# EAGLE schematic board (EAGLE 6.4)
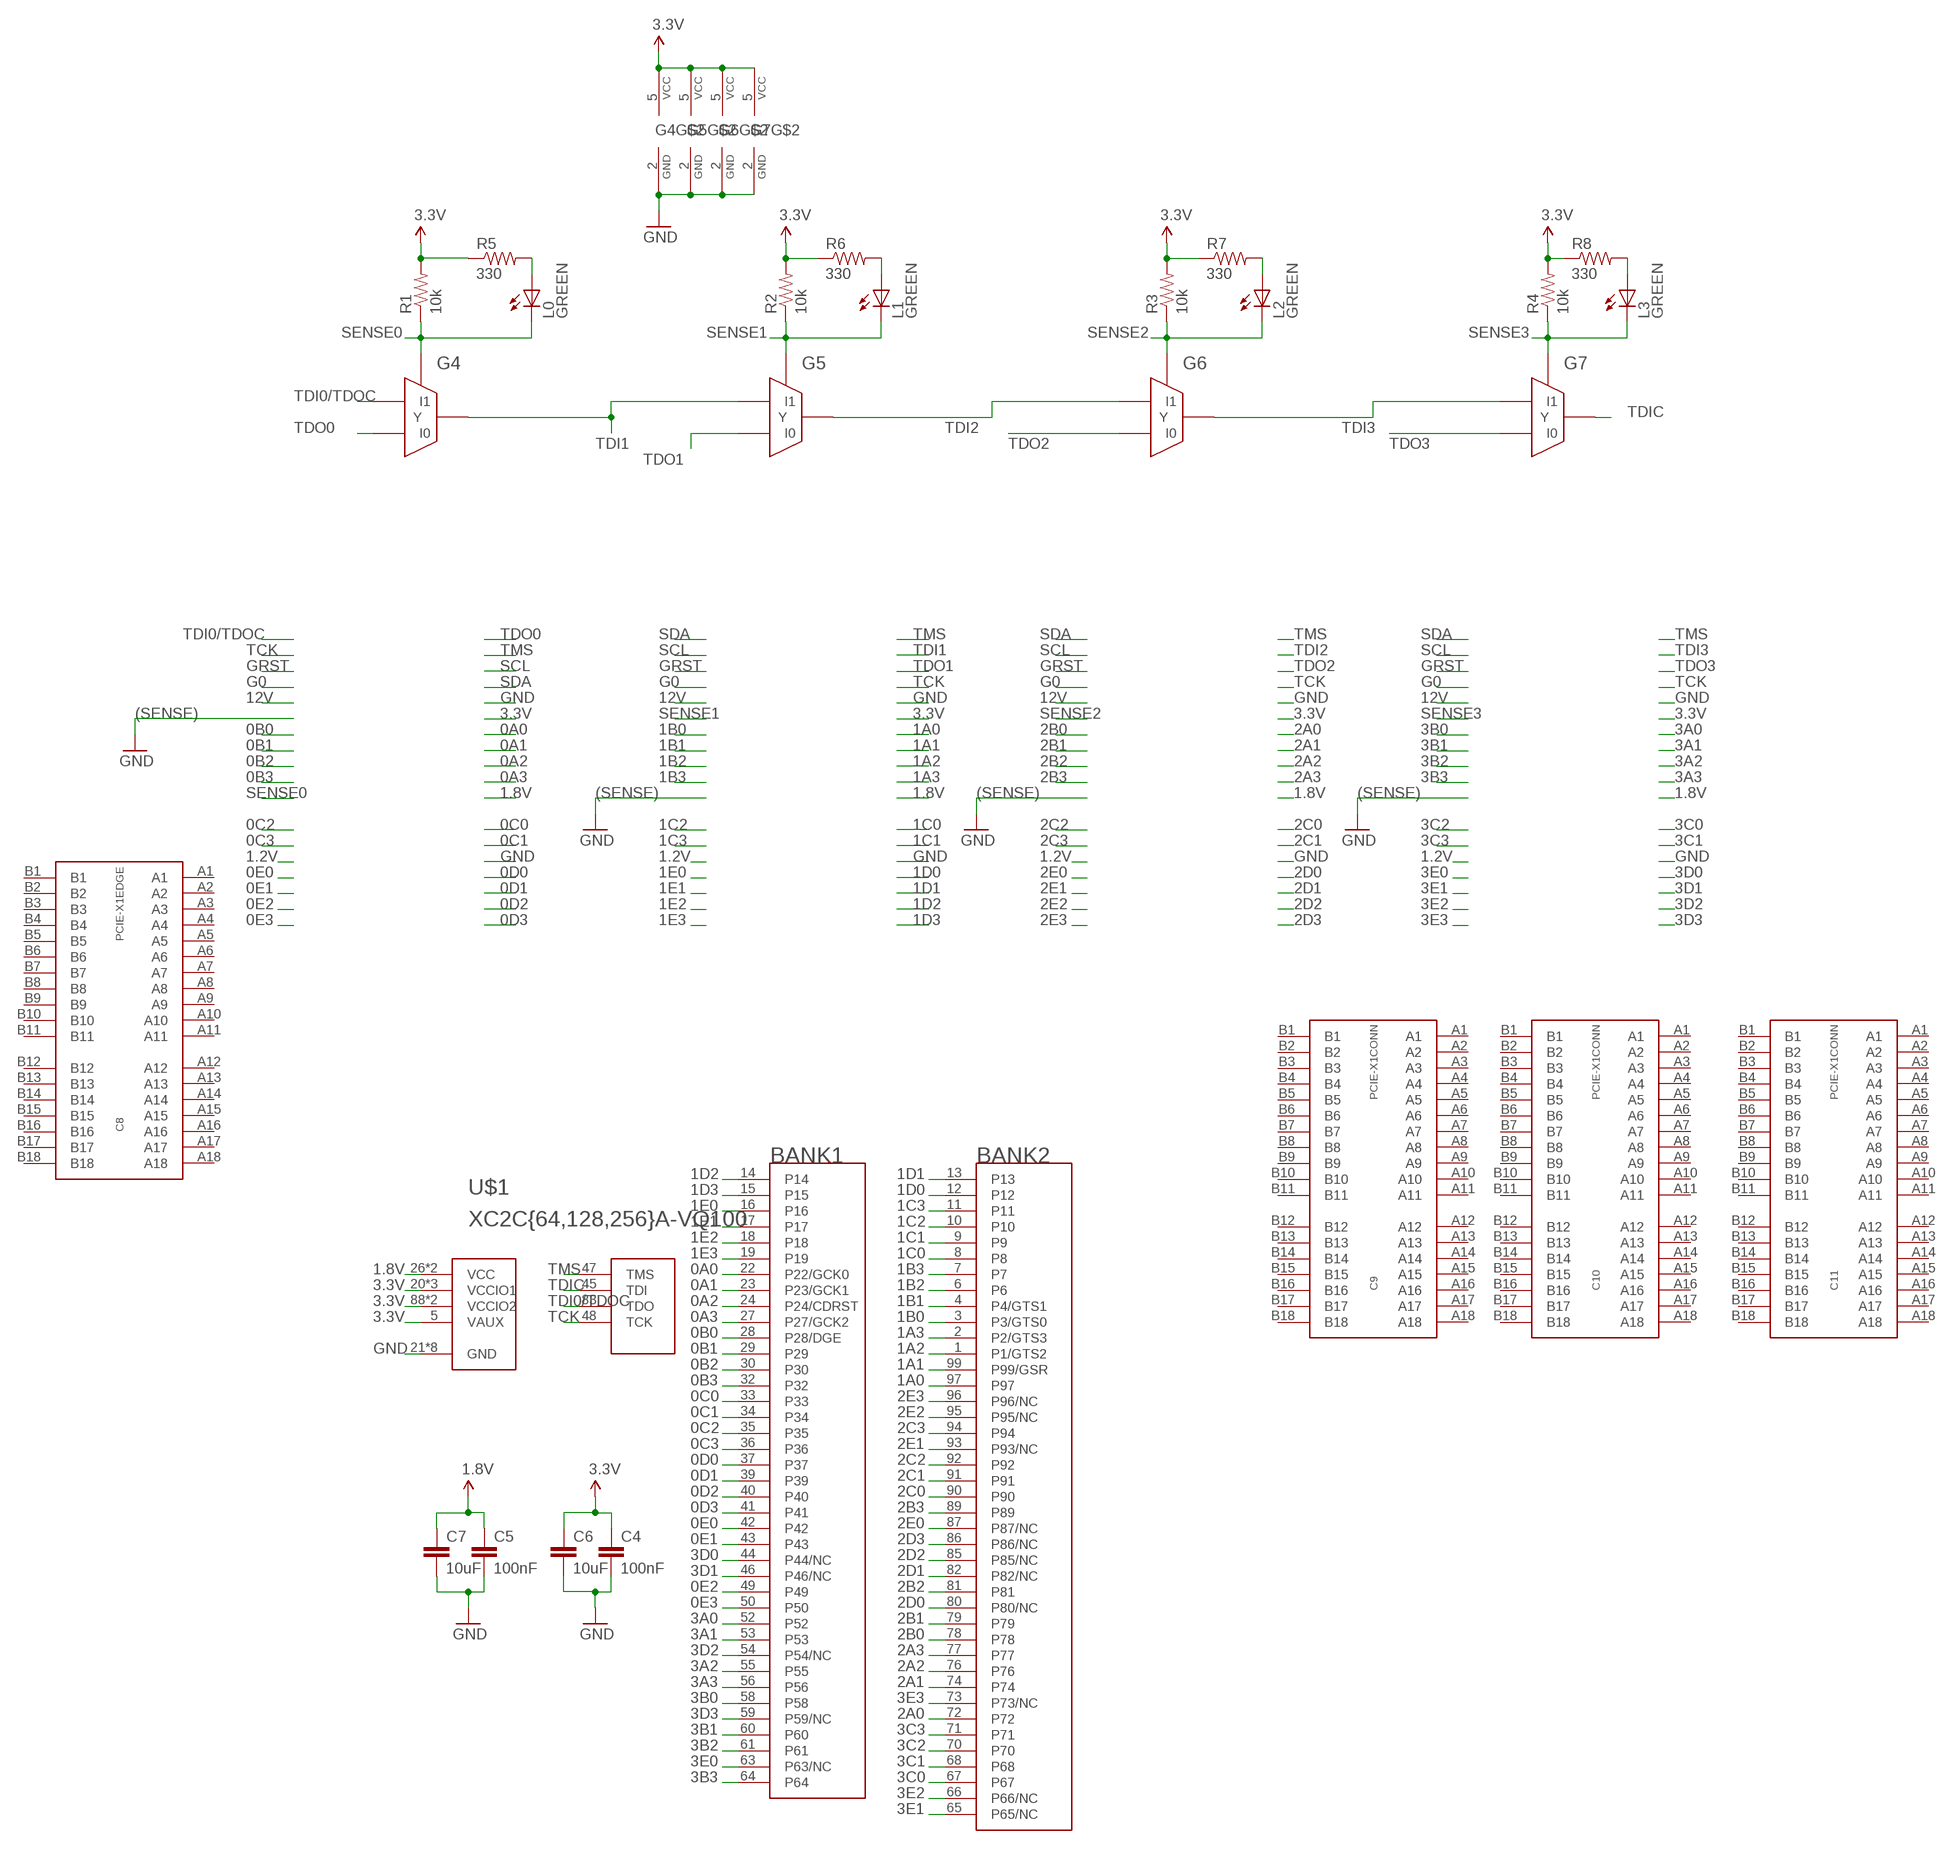
[diagram p0: schematic, sheet 1]

## Parts
C4  100nF  CAP0402-CAP  [0402-CAP]
C5  100nF  CAP0402-CAP  [0402-CAP]
C6  10uF  CAP0805  [0805]
C7  10uF  CAP0805  [0805]
C8  PCIE-X1EDGE  [PCIE-X1-EDGE]
C9  PCIE-X1CONN  [PCIE-X1-CONN]
C10  PCIE-X1CONN  [PCIE-X1-CONN]
C11  PCIE-X1CONN  [PCIE-X1-CONN]
G4  74G157  [SOT363]
G5  74G157  [SOT363]
G6  74G157  [SOT363]
G7  74G157  [SOT363]
L0  GREEN  LED0603  [0603_LED]
L1  GREEN  LED0603  [0603_LED]
L2  GREEN  LED0603  [0603_LED]
L3  GREEN  LED0603  [0603_LED]
R1  10k  RESISTOR0603  [0603-RES]
R2  10k  RESISTOR0603  [0603-RES]
R3  10k  RESISTOR0603  [0603-RES]
R4  10k  RESISTOR0603  [0603-RES]
R5  330  RESISTOR0603  [0603-RES]
R6  330  RESISTOR0603  [0603-RES]
R7  330  RESISTOR0603  [0603-RES]
R8  330  RESISTOR0603  [0603-RES]
U$1  XC2C{64,128,256}A-VQ100  [XILINX_TQ100]

## Nets
0A0: U$1.22(P22/GCK0)
0A1: U$1.23(P23/GCK1)
0A2: U$1.24(P24/CDRST)
0A3: U$1.27(P27/GCK2)
0B0: U$1.28(P28/DGE)
0B1: U$1.29
0B2: U$1.30
0B3: U$1.32
0C0: U$1.33
0C1: U$1.34
0C2: U$1.35
0C3: U$1.36
0D0: U$1.37
0D1: U$1.39
0D2: U$1.40
0D3: U$1.41
0E0: U$1.42
0E1: U$1.43
0E2: U$1.49
0E3: U$1.50
1.8V: C5.1 C7.1 U$1.26(VCC) U$1.57(VCC)
1A0: U$1.97
1A1: U$1.99(P99/GSR)
1A2: U$1.1(P1/GTS2)
1A3: U$1.2(P2/GTS3)
1B0: U$1.3(P3/GTS0)
1B1: U$1.4(P4/GTS1)
1B2: U$1.6
1B3: U$1.7
1C0: U$1.8
1C1: U$1.9
1C2: U$1.10
1C3: U$1.11
1D0: U$1.12
1D1: U$1.13
1D2: U$1.14
1D3: U$1.15
1E0: U$1.16
1E1: U$1.17
1E2: U$1.18
1E3: U$1.19
2A0: U$1.72
2A1: U$1.74
2A2: U$1.76
2A3: U$1.77
2B0: U$1.78
2B1: U$1.79
2B2: U$1.81
2B3: U$1.89
2C0: U$1.90
2C1: U$1.91
2C2: U$1.92
2C3: U$1.94
2D0: U$1.80(P80/NC)
2D1: U$1.82(P82/NC)
2D2: U$1.85(P85/NC)
2D3: U$1.86(P86/NC)
2E0: U$1.87(P87/NC)
2E1: U$1.93(P93/NC)
2E2: U$1.95(P95/NC)
2E3: U$1.96(P96/NC)
3.3V: C4.1 C6.1 G4.5(VCC) G5.5(VCC) G6.5(VCC) G7.5(VCC) R1.2 R2.2 R3.2 R4.2 R5.1 R6.1 R7.1 R8.1 U$1.5(VAUX) U$1.20(VCCIO1) U$1.38(VCCIO1) U$1.51(VCCIO1) U$1.88(VCCIO2) U$1.98(VCCIO2)
3A0: U$1.52
3A1: U$1.53
3A2: U$1.55
3A3: U$1.56
3B0: U$1.58
3B1: U$1.60
3B2: U$1.61
3B3: U$1.64
3C0: U$1.67
3C1: U$1.68
3C2: U$1.70
3C3: U$1.71
3D0: U$1.44(P44/NC)
3D1: U$1.46(P46/NC)
3D2: U$1.54(P54/NC)
3D3: U$1.59(P59/NC)
3E0: U$1.63(P63/NC)
3E1: U$1.65(P65/NC)
3E2: U$1.66(P66/NC)
3E3: U$1.73(P73/NC)
GND: C4.2 C5.2 C6.2 C7.2 G4.2(GND) G5.2(GND) G6.2(GND) G7.2(GND) U$1.21(GND) U$1.25(GND) U$1.31(GND) U$1.62(GND) U$1.69(GND) U$1.75(GND) U$1.84(GND) U$1.100(GND)
N$3: L0.A R5.2
N$7: L1.A R6.2
N$8: L2.A R7.2
N$9: L3.A R8.2
SENSE0: G4.6(S) L0.C R1.1
SENSE1: G5.6(S) L1.C R2.1
SENSE2: G6.6(S) L2.C R3.1
SENSE3: G7.6(S) L3.C R4.1
TCK: U$1.48(TCK)
TDI0/TDOC: G4.1(I1) U$1.83(TDO)
TDI1: G4.4(Y) G5.1(I1)
TDI2: G5.4(Y) G6.1(I1)
TDI3: G6.4(Y) G7.1(I1)
TDIC: G7.4(Y) U$1.45(TDI)
TDO0: G4.3(I0)
TDO1: G5.3(I0)
TDO2: G6.3(I0)
TDO3: G7.3(I0)
TMS: U$1.47(TMS)
Unconnected: C8.A1 C8.A2 C8.A3 C8.A4 C8.A5 C8.A6 C8.A7 C8.A8 C8.A9 C8.A10 C8.A11 C8.A12 C8.A13 C8.A14 C8.A15 C8.A16 C8.A17 C8.A18 C8.B1 C8.B2 C8.B3 C8.B4 C8.B5 C8.B6 C8.B7 C8.B8 C8.B9 C8.B10 C8.B11 C8.B12 C8.B13 C8.B14 C8.B15 C8.B16 C8.B17 C8.B18 C9.A1 C9.A2 C9.A3 C9.A4 C9.A5 C9.A6 C9.A7 C9.A8 C9.A9 C9.A10 C9.A11 C9.A12 C9.A13 C9.A14 C9.A15 C9.A16 C9.A17 C9.A18 C9.B1 C9.B2 C9.B3 C9.B4 C9.B5 C9.B6 C9.B7 C9.B8 C9.B9 C9.B10 C9.B11 C9.B12 C9.B13 C9.B14 C9.B15 C9.B16 C9.B17 C9.B18 C10.A1 C10.A2 C10.A3 C10.A4 C10.A5 C10.A6 C10.A7 C10.A8 C10.A9 C10.A10 C10.A11 C10.A12 C10.A13 C10.A14 C10.A15 C10.A16 C10.A17 C10.A18 C10.B1 C10.B2 C10.B3 C10.B4 C10.B5 C10.B6 C10.B7 C10.B8 C10.B9 C10.B10 C10.B11 C10.B12 C10.B13 C10.B14 C10.B15 C10.B16 C10.B17 C10.B18 C11.A1 C11.A2 C11.A3 C11.A4 C11.A5 C11.A6 C11.A7 C11.A8 C11.A9 C11.A10 C11.A11 C11.A12 C11.A13 C11.A14 C11.A15 C11.A16 C11.A17 C11.A18 C11.B1 C11.B2 C11.B3 C11.B4 C11.B5 C11.B6 C11.B7 C11.B8 C11.B9 C11.B10 C11.B11 C11.B12 C11.B13 C11.B14 C11.B15 C11.B16 C11.B17 C11.B18

## Notes on the sheet
- (SENSE)
- (SENSE) | (SENSE) | (SENSE)

## Library data of the parts
C4-C7 = kmod-passives:CAP: Capacitor Standard 0603 ceramic capacitor, and 0.1" leaded capacitor.
C8-C11 = kmod-connectors:PCIE-X1
G4-G7 = kmod-testing:74G157: Single gate mux Similar to the 74*157, but with just a single gate. This is the pinout used by Fairchild/NXP/Toshiba, but the TI parts swap the select (S) and output (Y) pins.
L0 L1-L3 = kmod-passives:LED
R1-R8 = kmod-passives:RESISTOR: Resistor Basic schematic elements and footprints for 0603, 1206, and PTH resistors.
U$1 = kmod-xilinx:XC2C{64,128,256}A-VQ100